# Altium project ATMEGA16_S52.PrjPCB
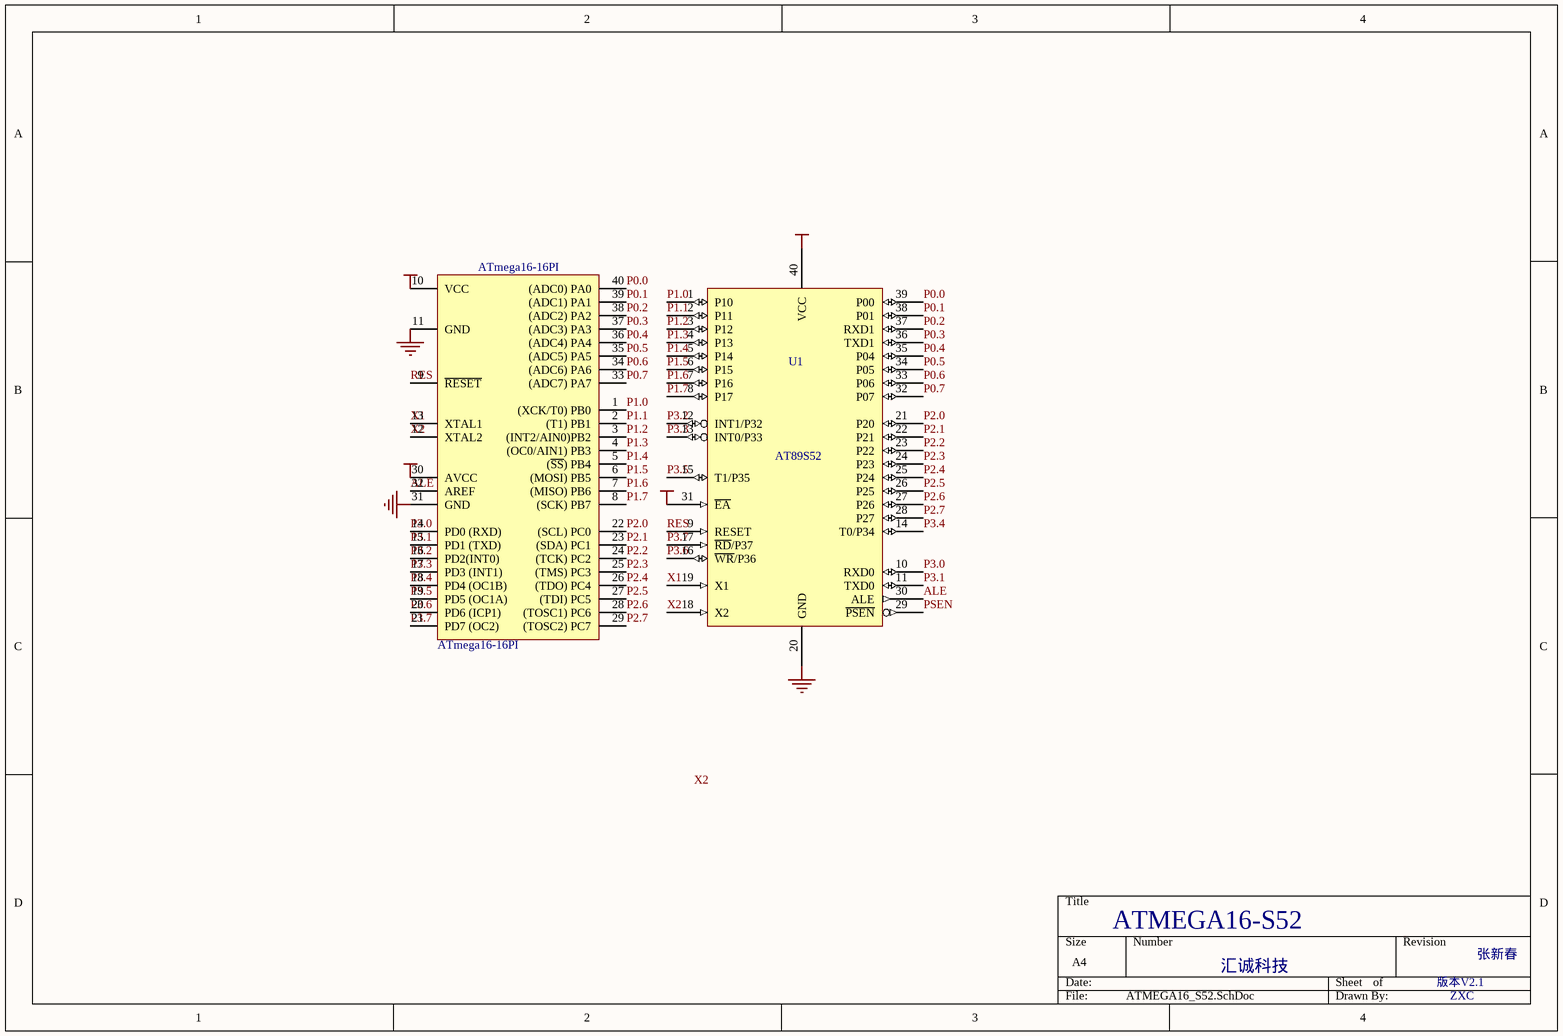
[diagram p0: ATMEGA16_S52.SchDoc]
1 sheet, 2 parts. Net scope: global (net labels, ports and power ports of the same name join across sheets).
Board file: ATMEGA16_S52.PcbDoc

## Sheet ATMEGA16_S52.SchDoc
size A4

### Parts
ATmega16-16PI  ATmega16-16PI  [底座DIP-40/引脚15.24mm]
U1  AT89S52  [DIP-40]

### Nets
GND: ATmega16-16PI.11(GND) ATmega16-16PI.31(GND) U1.20(GND)
VCC: ATmega16-16PI.10(VCC) ATmega16-16PI.30(AVCC) U1.31(~{EA}) U1.40(VCC)
ALE: ATmega16-16PI.32(AREF) U1.30(ALE)
P0.0: ATmega16-16PI.40((ADC0)_PA0) U1.39(P00)
P0.1: ATmega16-16PI.39((ADC1)_PA1) U1.38(P01)
P0.2: ATmega16-16PI.38((ADC2)_PA2) U1.37(RXD1)
P0.3: ATmega16-16PI.37((ADC3)_PA3) U1.36(TXD1)
P0.4: ATmega16-16PI.36((ADC4)_PA4) U1.35(P04)
P0.5: ATmega16-16PI.35((ADC5)_PA5) U1.34(P05)
P0.6: ATmega16-16PI.34((ADC6)_PA6) U1.33(P06)
P0.7: ATmega16-16PI.33((ADC7)_PA7) U1.32(P07)
P1.0: ATmega16-16PI.1((XCK/T0)_PB0) U1.1(P10)
P1.1: ATmega16-16PI.2((T1)_PB1) U1.2(P11)
P1.2: ATmega16-16PI.3((INT2/AIN0)PB2) U1.3(P12)
P1.3: ATmega16-16PI.4((OC0/AIN1)_PB3) U1.4(P13)
P1.4: ATmega16-16PI.5((~{SS})_PB4) U1.5(P14)
P1.5: ATmega16-16PI.6((MOSI)_PB5) U1.6(P15)
P1.6: ATmega16-16PI.7((MISO)_PB6) U1.7(P16)
P1.7: ATmega16-16PI.8((SCK)_PB7) U1.8(P17)
P2.0: ATmega16-16PI.22((SCL)_PC0) U1.21(P20)
P2.1: ATmega16-16PI.23((SDA)_PC1) U1.22(P21)
P2.2: ATmega16-16PI.24((TCK)_PC2) U1.23(P22)
P2.3: ATmega16-16PI.25((TMS)_PC3) U1.24(P23)
P2.4: ATmega16-16PI.26((TDO)_PC4) U1.25(P24)
P2.5: ATmega16-16PI.27((TDI)_PC5) U1.26(P25)
P2.6: ATmega16-16PI.28((TOSC1)_PC6) U1.27(P26)
P2.7: ATmega16-16PI.29((TOSC2)_PC7) U1.28(P27)
P3.0: ATmega16-16PI.14(PD0_(RXD)) U1.10(RXD0)
P3.1: ATmega16-16PI.15(PD1_(TXD)) U1.11(TXD0)
P3.2: ATmega16-16PI.16(PD2(INT0)) U1.12(INT1/P32)
P3.3: ATmega16-16PI.17(PD3_(INT1)) U1.13(INT0/P33)
P3.4: ATmega16-16PI.18(PD4_(OC1B)) U1.14(T0/P34)
P3.5: ATmega16-16PI.19(PD5_(OC1A)) U1.15(T1/P35)
P3.6: ATmega16-16PI.20(PD6_(ICP1)) U1.16(~{WR}/P36)
P3.7: ATmega16-16PI.21(PD7_(OC2)) U1.17(~{RD}/P37)
PSEN: U1.29(~{PSEN})
RES: ATmega16-16PI.9(~{RESET}) U1.9(RESET)
X1: ATmega16-16PI.13(XTAL1) U1.19(X1)
X2: ATmega16-16PI.12(XTAL2) U1.18(X2)

### Notes on the sheet
- ATMEGA16-S52
- 汇诚科技
- 版本V2.1
- 张新春
- ZXC
- Labels drawn without touching a wire or pin: X2

### Library data of the parts
ATmega16-16PI = ATmega16-P: 8 位微处理器/40引脚; 子类别: 微处理器; 发布者: 磊元工作室; 发布日期: 2003年8月18日; 制造商: Atmel Corporation; 类别: 集成电路; 元件名称（国标）: 8 位微处理器; 元件名称（英文）: 8-bit Microcontroller; 特性:存储器容量: Flash：16KB ，EEPROM：512B ，RAM：1KB; 特性:定时器/计数器: 2 个 8-bit ，1 个 16-bit; 特性:模/数转换器: 8 通道 10-bit ADC; 特性:指令: 两个时钟周期的硬件乘法器
U1 = 8051